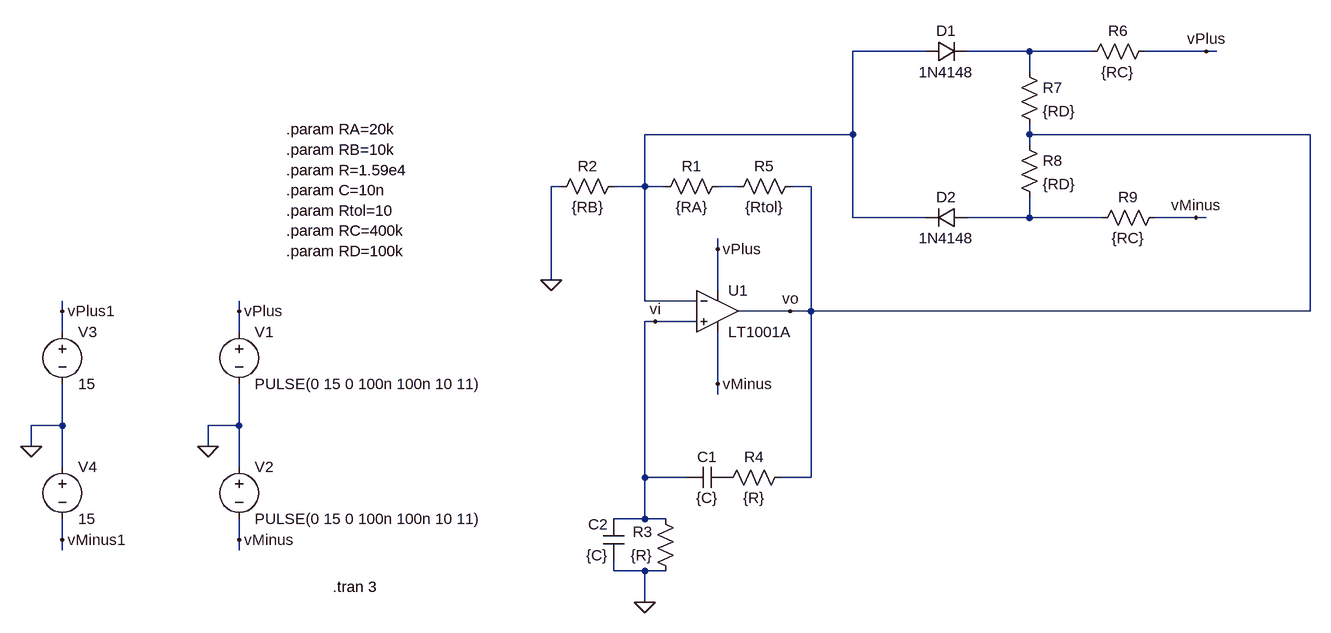
[diagram p0: schematic WienBridgeLimiter.asc]
WienBridgeLimiter.asc, the LTspice schematic file:
Version 4
SHEET 1 1556 772
WIRE 736 -400 624 -400
WIRE 896 -400 800 -400
WIRE 992 -400 896 -400
WIRE 1168 -400 1072 -400
WIRE 1184 -400 1168 -400
WIRE 896 -368 896 -400
WIRE 624 -272 624 -400
WIRE 624 -272 304 -272
WIRE 896 -272 896 -288
WIRE 1328 -272 896 -272
WIRE 896 -256 896 -272
WIRE 176 -192 160 -192
WIRE 304 -192 304 -272
WIRE 304 -192 256 -192
WIRE 336 -192 304 -192
WIRE 448 -192 416 -192
WIRE 560 -192 528 -192
WIRE 624 -144 624 -272
WIRE 736 -144 624 -144
WIRE 896 -144 896 -176
WIRE 896 -144 800 -144
WIRE 1008 -144 896 -144
WIRE 1152 -144 1088 -144
WIRE 1168 -144 1152 -144
WIRE 416 -96 416 -112
WIRE 160 -48 160 -192
WIRE 416 -32 416 -96
WIRE 304 -16 304 -192
WIRE 384 -16 304 -16
WIRE -592 0 -592 -16
WIRE -320 0 -320 -16
WIRE 528 0 448 0
WIRE 560 0 560 -192
WIRE 560 0 528 0
WIRE 1328 0 1328 -272
WIRE 1328 0 560 0
WIRE 320 16 304 16
WIRE 384 16 320 16
WIRE -592 32 -592 0
WIRE -320 32 -320 0
WIRE 416 112 416 32
WIRE 416 128 416 112
WIRE -592 176 -592 112
WIRE -592 176 -640 176
WIRE -320 176 -320 112
WIRE -320 176 -368 176
WIRE -640 208 -640 176
WIRE -368 208 -368 176
WIRE -592 240 -592 176
WIRE -320 240 -320 176
WIRE 304 256 304 16
WIRE 368 256 304 256
WIRE 560 256 560 0
WIRE 560 256 512 256
WIRE 304 320 304 256
WIRE 304 320 256 320
WIRE 336 320 304 320
WIRE -592 352 -592 320
WIRE -320 352 -320 320
WIRE -592 368 -592 352
WIRE -320 368 -320 352
WIRE 256 400 256 384
WIRE 304 400 256 400
WIRE 336 400 304 400
WIRE 304 448 304 400
FLAG 160 -48 0
FLAG -368 208 0
FLAG -320 352 vMinus
FLAG 416 -96 vPlus
FLAG 416 112 vMinus
FLAG 528 0 vo
FLAG 320 16 vi
FLAG 304 448 0
FLAG -640 208 0
FLAG -592 0 vPlus1
FLAG -592 352 vMinus1
FLAG -320 0 vPlus
FLAG 1168 -400 vPlus
FLAG 1152 -144 vMinus
SYMBOL Opamps\\LT1001A 416 -64 R0
SYMATTR InstName U1
SYMBOL voltage -320 16 R0
WINDOW 123 0 0 Left 2
WINDOW 39 0 0 Left 2
SYMATTR InstName V1
SYMATTR Value PULSE(0 15 0 100n 100n 10 11)
SYMBOL voltage -320 224 R0
WINDOW 123 0 0 Left 2
WINDOW 39 0 0 Left 2
SYMATTR InstName V2
SYMATTR Value PULSE(0 15 0 100n 100n 10 11)
SYMBOL res 432 -208 R90
WINDOW 0 0 56 VBottom 2
WINDOW 3 32 56 VTop 2
SYMATTR InstName R1
SYMATTR Value {RA}
SYMBOL res 272 -208 R90
WINDOW 0 0 56 VBottom 2
WINDOW 3 32 56 VTop 2
SYMATTR InstName R2
SYMATTR Value {RB}
SYMBOL res 352 416 R180
WINDOW 0 36 76 Left 2
WINDOW 3 36 40 Left 2
SYMATTR InstName R3
SYMATTR Value {R}
SYMBOL res 528 240 R90
WINDOW 0 0 56 VBottom 2
WINDOW 3 32 56 VTop 2
SYMATTR InstName R4
SYMATTR Value {R}
SYMBOL cap 432 240 R90
WINDOW 0 0 32 VBottom 2
WINDOW 3 32 32 VTop 2
SYMATTR InstName C1
SYMATTR Value {C}
SYMBOL cap 272 384 R180
WINDOW 0 24 56 Left 2
WINDOW 3 24 8 Left 2
SYMATTR InstName C2
SYMATTR Value {C}
SYMBOL res 544 -208 R90
WINDOW 0 0 56 VBottom 2
WINDOW 3 32 56 VTop 2
SYMATTR InstName R5
SYMATTR Value {Rtol}
SYMBOL voltage -592 16 R0
WINDOW 123 0 0 Left 2
WINDOW 39 0 0 Left 2
SYMATTR InstName V3
SYMATTR Value 15
SYMBOL voltage -592 224 R0
WINDOW 123 0 0 Left 2
WINDOW 39 0 0 Left 2
SYMATTR InstName V4
SYMATTR Value 15
SYMBOL res 1088 -416 R90
WINDOW 0 0 56 VBottom 2
WINDOW 3 32 56 VTop 2
SYMATTR InstName R6
SYMATTR Value {RC}
SYMBOL res 880 -384 R0
SYMATTR InstName R7
SYMATTR Value {RD}
SYMBOL res 880 -272 R0
SYMATTR InstName R8
SYMATTR Value {RD}
SYMBOL res 992 -128 R270
WINDOW 0 32 56 VTop 2
WINDOW 3 0 56 VBottom 2
SYMATTR InstName R9
SYMATTR Value {RC}
SYMBOL diode 736 -384 R270
WINDOW 0 32 32 VTop 2
WINDOW 3 0 32 VBottom 2
SYMATTR InstName D1
SYMATTR Value 1N4148
SYMBOL diode 800 -160 R90
WINDOW 0 0 32 VBottom 2
WINDOW 3 32 32 VTop 2
SYMATTR InstName D2
SYMATTR Value 1N4148
TEXT -176 424 Left 2 !.tran 3
TEXT -248 -280 Left 2 !.param RA=20k\n.param RB=10k\n.param R=1.59e4\n.param C=10n\n.param Rtol=10\n.param RC=400k\n.param RD=100k

The netlist it stands for:
* WienBridgeLimiter.asc
XU1 vi N001 vPlus vMinus vo LT1001  ; LT1001A, pins In+ In- V+ V- OUT
V1 vPlus 0 PULSE(0 15 0 100n 100n 10 11)
V2 0 vMinus PULSE(0 15 0 100n 100n 10 11)
R1 N003 N001 {RA}
R2 N001 0 {RB}
R3 0 vi {R}
R4 vo P001 {R}
C1 P001 vi {C}
C2 0 vi {C}
R5 vo N003 {Rtol}
V3 vPlus1 0 15
V4 0 vMinus1 15
R6 vPlus N002 {RC}
R7 N002 vo {RD}
R8 vo N004 {RD}
R9 N004 vMinus {RC}
D1 N001 N002 1N4148
D2 N004 N001 1N4148
.model D D
.lib standard.dio
.tran 3
.param RA=20k
.param RB=10k
.param R=1.59e4
.param C=10n
.param Rtol=10
.param RC=400k
.param RD=100k
.lib LTC.lib
.backanno
.end